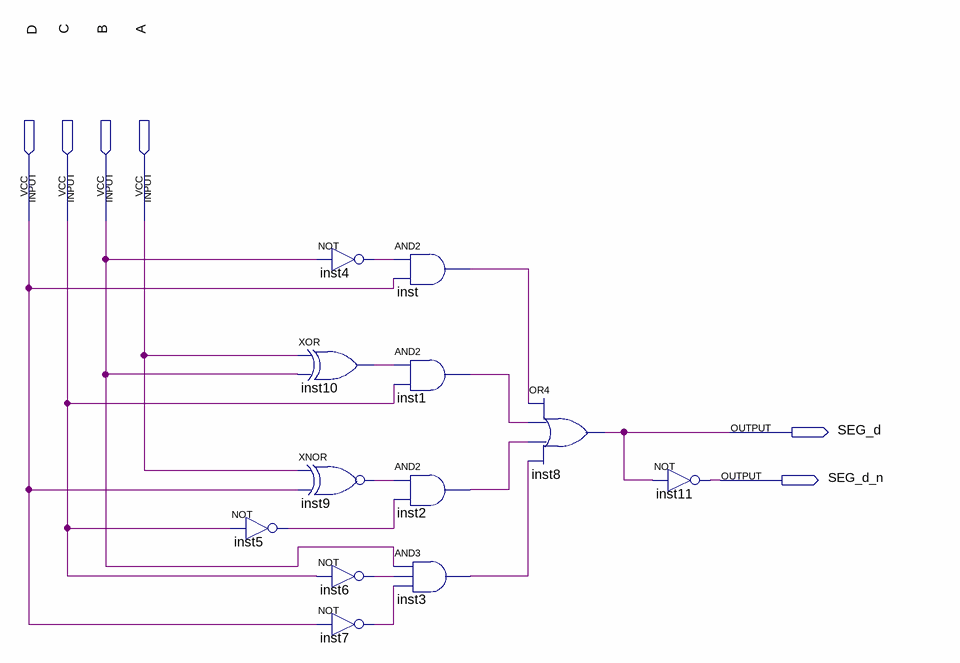
[diagram p0: schematic sheet]
// Quartus schematic SEG_D.bdf as structural Verilog: 12 symbols, 6 pins
module SEG_D (
  input  D,
  input  C,
  input  B,
  input  A,
  output SEG_d,
  output SEG_d_n
);

  wire inst1_out, inst2_out, inst3_out, inst4_out, inst5_out, inst6_out, inst7_out, inst9_out, inst10_out,
       inst_out;

  xor inst10 (inst10_out, A, B);
  xnor inst9 (inst9_out, A, D);
  not inst5 (inst5_out, C);
  not inst4 (inst4_out, B);
  not inst6 (inst6_out, C);
  not inst7 (inst7_out, D);
  and inst (inst_out, inst4_out, D);
  and inst1 (inst1_out, inst10_out, C);
  and inst2 (inst2_out, inst9_out, inst5_out);
  and inst3 (inst3_out, B, inst6_out, inst7_out);
  or inst8 (SEG_d, inst_out, inst1_out, inst2_out, inst3_out);
  not inst11 (SEG_d_n, SEG_d);
endmodule
